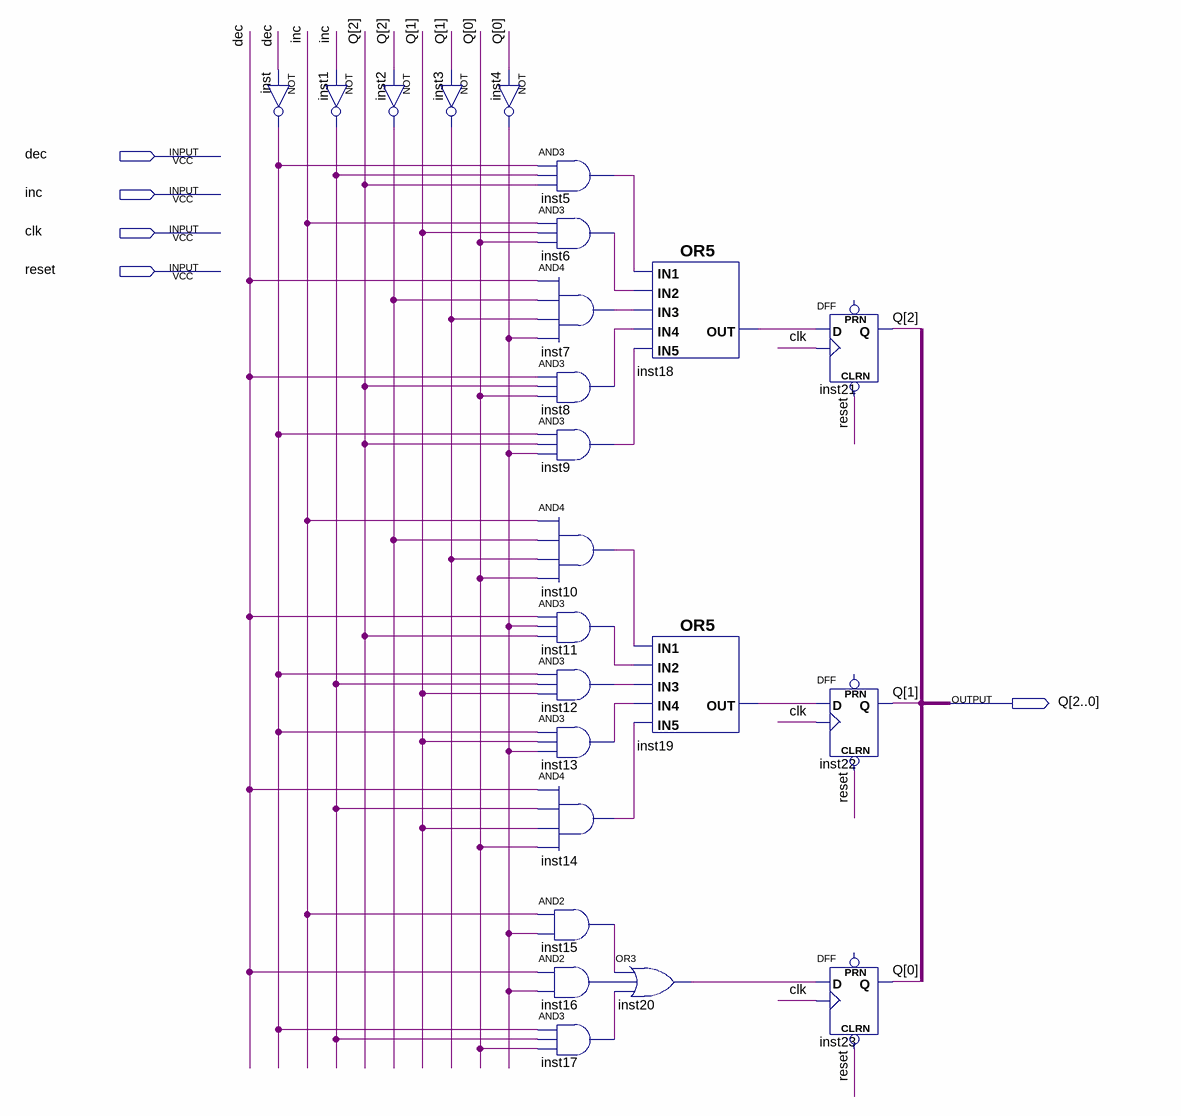
[diagram p0: schematic sheet]
// Quartus schematic CONTADOR_6.bdf as structural Verilog: 24 symbols, 5 pins
module CONTADOR_6 (
  input  dec,
  input  inc,
  input  clk,
  input  reset,
  output [2:0] Q
);

  wire inst1_out, inst2_out, inst3_out, inst4_out, inst5_out, inst6_out, inst7_out, inst8_out, inst9_out,
       inst10_out, inst11_out, inst12_out, inst13_out, inst14_out, inst15_out, inst16_out, inst17_out,
       inst18_out, inst19_out, inst20_out, inst_out;

  not inst1 (inst1_out, inc);
  not inst (inst_out, dec);
  not inst2 (inst2_out, Q[2]);
  not inst3 (inst3_out, Q[1]);
  not inst4 (inst4_out, Q[0]);
  and inst5 (inst5_out, inst_out, inst1_out, Q[2]);
  and inst6 (inst6_out, inc, Q[1], Q[0]);
  and inst7 (inst7_out, dec, inst2_out, inst3_out, inst4_out);
  and inst8 (inst8_out, dec, Q[2], Q[0]);
  and inst9 (inst9_out, inst_out, Q[2], inst4_out);
  and inst10 (inst10_out, inc, inst2_out, inst3_out, Q[0]);
  and inst11 (inst11_out, dec, inst4_out, Q[2]);
  and inst12 (inst12_out, inst_out, inst1_out, Q[1]);
  and inst13 (inst13_out, inst_out, Q[1], inst4_out);
  and inst14 (inst14_out, dec, inst1_out, Q[1], Q[0]);
  and inst15 (inst15_out, inc, inst4_out);
  and inst16 (inst16_out, dec, inst4_out);
  and inst17 (inst17_out, inst_out, inst1_out, Q[0]);
  or inst18 (inst18_out, inst5_out, inst6_out, inst7_out, inst8_out, inst9_out);
  or inst19 (inst19_out, inst10_out, inst11_out, inst12_out, inst13_out, inst14_out);
  or inst20 (inst20_out, inst15_out, inst16_out, inst17_out);
  DFF inst21 (.CLRN(reset), .CLK(clk), .D(inst18_out), .Q(Q[2]));  // open: PRN
  DFF inst22 (.CLRN(reset), .CLK(clk), .D(inst19_out), .Q(Q[1]));  // open: PRN
  DFF inst23 (.CLRN(reset), .CLK(clk), .D(inst20_out), .Q(Q[0]));  // open: PRN
endmodule
